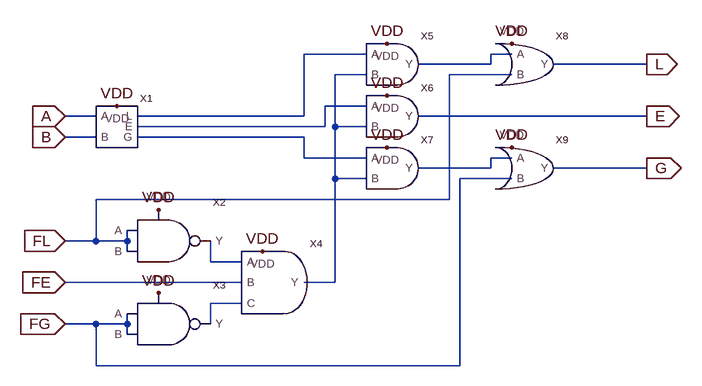
[diagram p0: schematic full-comparator-seq-hided-nand.asc]
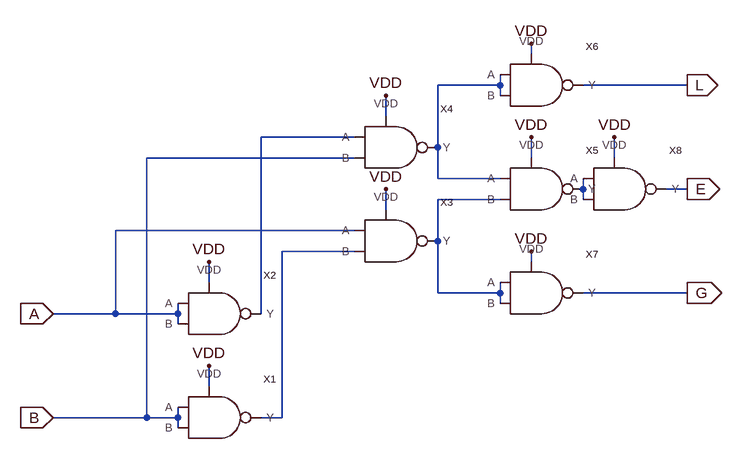
[diagram p1: sub-circuit full-comparator1.asc]
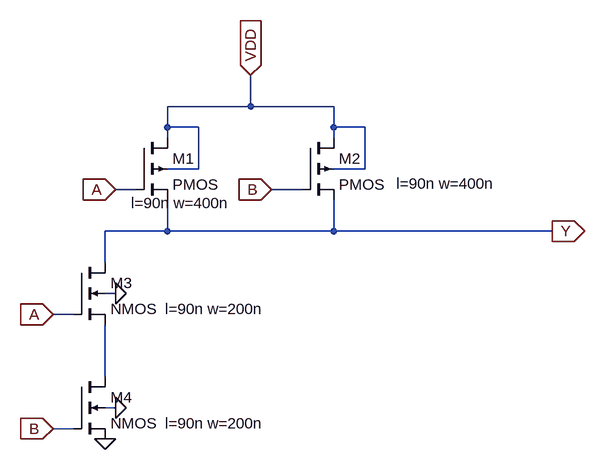
[diagram p2: sub-circuit nand.asc]
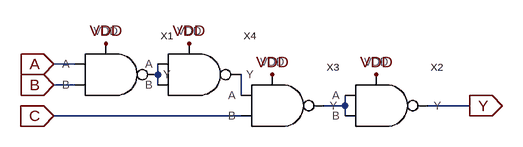
[diagram p3: sub-circuit and3.asc]
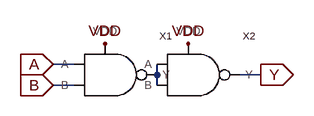
[diagram p4: sub-circuit and.asc]
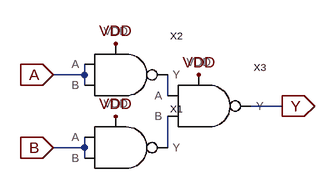
[diagram p5: sub-circuit or.asc]
full-comparator-seq-hided-nand.asc, the LTspice schematic file:
Version 4
SHEET 1 880 680
WIRE 224 -192 128 -192
WIRE 448 -192 416 -192
WIRE 416 -176 416 -192
WIRE 416 -176 304 -176
WIRE 656 -176 512 -176
WIRE 224 -160 176 -160
WIRE 448 -160 352 -160
WIRE 224 -112 160 -112
WIRE -192 -96 -240 -96
WIRE 128 -96 128 -192
WIRE 128 -96 -128 -96
WIRE 656 -96 304 -96
WIRE 160 -80 160 -112
WIRE 160 -80 -128 -80
WIRE 176 -80 176 -160
WIRE 224 -80 176 -80
WIRE -192 -64 -240 -64
WIRE 128 -64 -128 -64
WIRE 128 -32 128 -64
WIRE 224 -32 128 -32
WIRE 448 -32 416 -32
WIRE 416 -16 416 -32
WIRE 416 -16 304 -16
WIRE 656 -16 512 -16
WIRE 176 0 176 -80
WIRE 224 0 176 0
WIRE 448 0 368 0
WIRE 352 32 352 -160
WIRE 352 32 -192 32
WIRE -192 96 -192 32
WIRE -192 96 -240 96
WIRE -144 96 -144 80
WIRE -144 96 -192 96
WIRE -144 112 -144 96
WIRE -16 128 -16 96
WIRE 32 128 -16 128
WIRE 32 160 -240 160
WIRE 176 160 176 0
WIRE 176 160 128 160
WIRE 32 192 -16 192
WIRE -192 224 -240 224
WIRE -144 224 -144 208
WIRE -144 224 -192 224
WIRE -16 224 -16 192
WIRE -144 240 -144 224
WIRE -192 288 -192 224
WIRE 368 288 368 0
WIRE 368 288 -192 288
FLAG -240 -96 A
IOPIN -240 -96 In
FLAG -240 -64 B
IOPIN -240 -64 In
FLAG -160 -112 VDD
FLAG -240 96 FL
IOPIN -240 96 In
FLAG -240 160 FE
IOPIN -240 160 In
FLAG -240 224 FG
IOPIN -240 224 In
FLAG 656 -176 L
IOPIN 656 -176 Out
FLAG 656 -96 E
IOPIN 656 -96 Out
FLAG 656 -16 G
IOPIN 656 -16 Out
FLAG 64 112 VDD
FLAG -96 48 VDD
FLAG -96 176 VDD
FLAG 256 -208 VDD
FLAG 256 -128 VDD
FLAG 256 -48 VDD
FLAG 448 -208 VDD
FLAG 448 -48 VDD
SYMBOL full-comparator1 -160 -80 R0
SYMATTR InstName X1
SYMBOL nand -96 96 R0
SYMATTR InstName X2
SYMBOL nand -96 224 R0
SYMATTR InstName X3
SYMBOL and3 64 160 R0
SYMATTR InstName X4
SYMBOL and 256 -176 R0
SYMATTR InstName X5
SYMBOL and 256 -96 R0
SYMATTR InstName X6
SYMBOL and 256 -16 R0
SYMATTR InstName X7
SYMBOL or 464 -176 R0
SYMATTR InstName X8
SYMBOL or 464 -16 R0
SYMATTR InstName X9

full-comparator1.asc, the sub-circuit schematic file:
Version 4
SHEET 1 880 680
WIRE 240 -320 240 -336
WIRE 192 -272 192 -288
WIRE 192 -272 96 -272
WIRE 480 -272 320 -272
WIRE 192 -256 192 -272
WIRE 16 -224 16 -256
WIRE -32 -192 -176 -192
WIRE 96 -176 96 -272
WIRE -32 -160 -352 -160
WIRE 240 -160 240 -192
WIRE 368 -160 368 -192
WIRE 96 -128 96 -176
WIRE 192 -128 96 -128
WIRE 320 -112 320 -128
WIRE 480 -112 448 -112
WIRE 192 -96 96 -96
WIRE 320 -96 320 -112
WIRE 16 -80 16 -112
WIRE -32 -48 -400 -48
WIRE 96 -32 96 -96
WIRE -32 -16 -144 -16
WIRE 240 0 240 -16
WIRE -256 32 -256 0
WIRE 96 48 96 -32
WIRE 192 48 192 32
WIRE 192 48 96 48
WIRE 480 48 320 48
WIRE 192 64 192 48
WIRE -400 80 -400 -48
WIRE -400 80 -496 80
WIRE -304 80 -304 64
WIRE -304 80 -400 80
WIRE -176 80 -176 -192
WIRE -304 96 -304 80
WIRE -256 192 -256 160
WIRE -352 240 -352 -160
WIRE -352 240 -496 240
WIRE -304 240 -304 224
WIRE -304 240 -352 240
WIRE -144 240 -144 -16
WIRE -144 240 -176 240
WIRE -304 256 -304 240
FLAG -496 240 B
IOPIN -496 240 In
FLAG -496 80 A
IOPIN -496 80 In
FLAG 480 -112 E
IOPIN 480 -112 Out
FLAG -256 160 VDD
FLAG -256 0 VDD
FLAG 16 -256 VDD
FLAG 16 -112 VDD
FLAG 240 -192 VDD
FLAG 480 48 G
IOPIN 480 48 Out
FLAG 480 -272 L
IOPIN 480 -272 Out
FLAG 240 -16 VDD
FLAG 240 -336 VDD
FLAG 368 -192 VDD
SYMBOL nand -256 240 R0
SYMATTR InstName X1
SYMBOL nand -256 80 R0
SYMATTR InstName X2
SYMBOL nand 16 -32 R0
SYMATTR InstName X3
SYMBOL nand 16 -176 R0
SYMATTR InstName X4
SYMBOL nand 240 -112 R0
SYMATTR InstName X5
SYMBOL nand 240 -272 R0
SYMATTR InstName X6
SYMBOL nand 240 48 R0
SYMATTR InstName X7
SYMBOL nand 368 -112 R0
SYMATTR InstName X8

nand.asc, the sub-circuit schematic file:
Version 4
SHEET 1 1436 680
WIRE 896 -896 896 -944
WIRE 896 -896 768 -896
WIRE 1024 -896 896 -896
WIRE 768 -864 768 -896
WIRE 816 -864 768 -864
WIRE 1024 -864 1024 -896
WIRE 1072 -864 1024 -864
WIRE 768 -848 768 -864
WIRE 1024 -848 1024 -864
WIRE 816 -800 816 -864
WIRE 816 -800 768 -800
WIRE 1072 -800 1072 -864
WIRE 1072 -800 1024 -800
WIRE 720 -768 688 -768
WIRE 976 -768 928 -768
WIRE 768 -704 768 -752
WIRE 768 -704 672 -704
WIRE 1024 -704 1024 -752
WIRE 1024 -704 768 -704
WIRE 1360 -704 1024 -704
WIRE 672 -656 672 -704
WIRE 688 -608 672 -608
WIRE 624 -576 592 -576
WIRE 672 -480 672 -560
WIRE 688 -432 672 -432
WIRE 624 -400 592 -400
FLAG 688 -768 A
IOPIN 688 -768 In
FLAG 592 -576 A
IOPIN 592 -576 In
FLAG 1360 -704 Y
IOPIN 1360 -704 Out
FLAG 896 -944 VDD
IOPIN 896 -944 In
FLAG 928 -768 B
IOPIN 928 -768 In
FLAG 592 -400 B
IOPIN 592 -400 In
FLAG 688 -608 0
FLAG 688 -432 0
FLAG 672 -384 0
SYMBOL pmos4 720 -848 R0
WINDOW 123 -8 101 Left 2
SYMATTR InstName M1
SYMATTR Value2 l=90n w=400n
SYMBOL pmos4 976 -848 R0
WINDOW 123 144 71 Left 2
SYMATTR InstName M2
SYMATTR Value2 l=90n w=400n
SYMBOL nmos4 624 -656 R0
WINDOW 123 140 72 Left 2
SYMATTR InstName M3
SYMATTR Value2 l=90n w=200n
SYMBOL nmos4 624 -480 R0
WINDOW 123 140 72 Left 2
SYMATTR InstName M4
SYMATTR Value2 l=90n w=200n

and3.asc, the sub-circuit schematic file:
Version 4
SHEET 1 880 680
WIRE 144 144 112 144
WIRE 272 160 272 144
WIRE 144 176 112 176
WIRE 272 176 272 160
WIRE 400 192 400 160
WIRE 560 208 560 192
WIRE 560 208 528 208
WIRE 752 208 688 208
WIRE 400 224 112 224
WIRE 560 224 560 208
FLAG 112 144 A
IOPIN 112 144 In
FLAG 192 112 VDD
FLAG 448 160 VDD
FLAG 320 112 VDD
FLAG 112 176 B
IOPIN 112 176 In
FLAG 112 224 C
IOPIN 112 224 In
FLAG 608 160 VDD
FLAG 752 208 Y
IOPIN 752 208 Out
SYMBOL nand 192 160 R0
SYMATTR InstName X1
SYMBOL nand 448 208 R0
SYMATTR InstName X3
SYMBOL nand 320 160 R0
SYMATTR InstName X4
SYMBOL nand 608 208 R0
SYMATTR InstName X2

and.asc, the sub-circuit schematic file:
Version 4
SHEET 1 880 680
WIRE 112 128 80 128
WIRE 240 144 240 128
WIRE 400 144 368 144
WIRE 112 160 80 160
WIRE 240 160 240 144
FLAG 80 128 A
IOPIN 80 128 In
FLAG 80 160 B
IOPIN 80 160 In
FLAG 400 144 Y
IOPIN 400 144 Out
FLAG 160 96 VDD
FLAG 288 96 VDD
SYMBOL nand 160 144 R0
SYMATTR InstName X1
SYMBOL nand 288 144 R0
SYMATTR InstName X2

or.asc, the sub-circuit schematic file:
Version 4
SHEET 1 880 680
WIRE 80 112 80 96
WIRE 80 112 32 112
WIRE 80 128 80 112
WIRE 208 144 208 112
WIRE 384 160 336 160
WIRE 80 224 80 208
WIRE 80 224 32 224
WIRE 208 224 208 176
WIRE 80 240 80 224
FLAG 32 112 A
IOPIN 32 112 In
FLAG 32 224 B
IOPIN 32 224 In
FLAG 384 160 Y
IOPIN 384 160 Out
FLAG 128 64 VDD
FLAG 128 176 VDD
FLAG 256 112 VDD
SYMBOL nand 128 224 R0
SYMATTR InstName X1
SYMBOL nand 128 112 R0
SYMATTR InstName X2
SYMBOL nand 256 160 R0
SYMATTR InstName X3

The netlist it stands for:
* full-comparator-seq-hided-nand.asc
XX1 A B VDD N001 N004 N005 full-comparator1
XX2 FL FL VDD N007 nand
XX3 FG FG VDD N008 nand
XX4 N007 FE N008 VDD N003 and3
XX5 N001 N003 VDD N002 and
XX6 N004 N003 VDD E and
XX7 N005 N003 VDD N006 and
XX8 N002 FL VDD L or
XX9 N006 FG VDD G or

* block symbol definitions
.subckt full-comparator1 A B VDD L E G
XX1 B B VDD N005 nand
XX2 A A VDD N002 nand
XX3 A N005 VDD N004 nand
XX4 N002 B VDD N001 nand
XX5 N001 N004 VDD N003 nand
XX6 N001 N001 VDD L nand
XX7 N004 N004 VDD G nand
XX8 N003 N003 VDD E nand
.ends full-comparator1

.subckt nand A B VDD Y
M1 VDD A Y VDD PMOS l=90n w=400n
M2 VDD B Y VDD PMOS l=90n w=400n
M3 Y A N001 0 NMOS l=90n w=200n
M4 N001 B 0 0 NMOS l=90n w=200n
.ends nand

.subckt and3 A B C VDD Y
XX1 A B VDD N001 nand
XX3 N002 C VDD N003 nand
XX4 N001 N001 VDD N002 nand
XX2 N003 N003 VDD Y nand
.ends and3

.subckt and A B VDD Y
XX1 A B VDD N001 nand
XX2 N001 N001 VDD Y nand
.ends and

.subckt or A B VDD Y
XX1 B B VDD N002 nand
XX2 A A VDD N001 nand
XX3 N001 N002 VDD Y nand
.ends or

.model NMOS NMOS
.model PMOS PMOS
.lib standard.mos
.backanno
.end